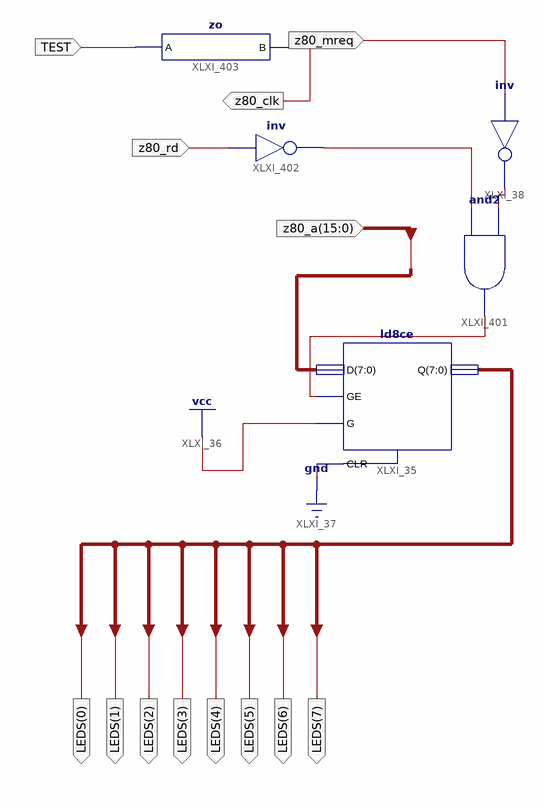
[diagram p0: schematic sheet 1]
// Xilinx ISE schematic Z80_adresses_test_external_z80.sch (spartan3) as structural Verilog: 5 symbols, 13 ports
module Z80_adresses_test_external_z80 (
  input  [15:0] z80_a,
  input  z80_mreq,
  input  TEST,
  input  z80_rd,
  output [7:0] LEDS,
  output z80_clk
);

  wire XLXN_100, XLXN_101, XLXN_102;

  not XLXI_38 (XLXN_102, z80_mreq);
  ld8ce XLXI_35 (.CLR(1'b0), .D(z80_a[7:0]), .G(1'b1), .GE(XLXN_100), .Q(LEDS));
  and XLXI_401 (XLXN_100, XLXN_101, XLXN_102);
  not XLXI_402 (XLXN_101, z80_rd);
  zo XLXI_403 (.A(TEST), .B(z80_clk));
endmodule
